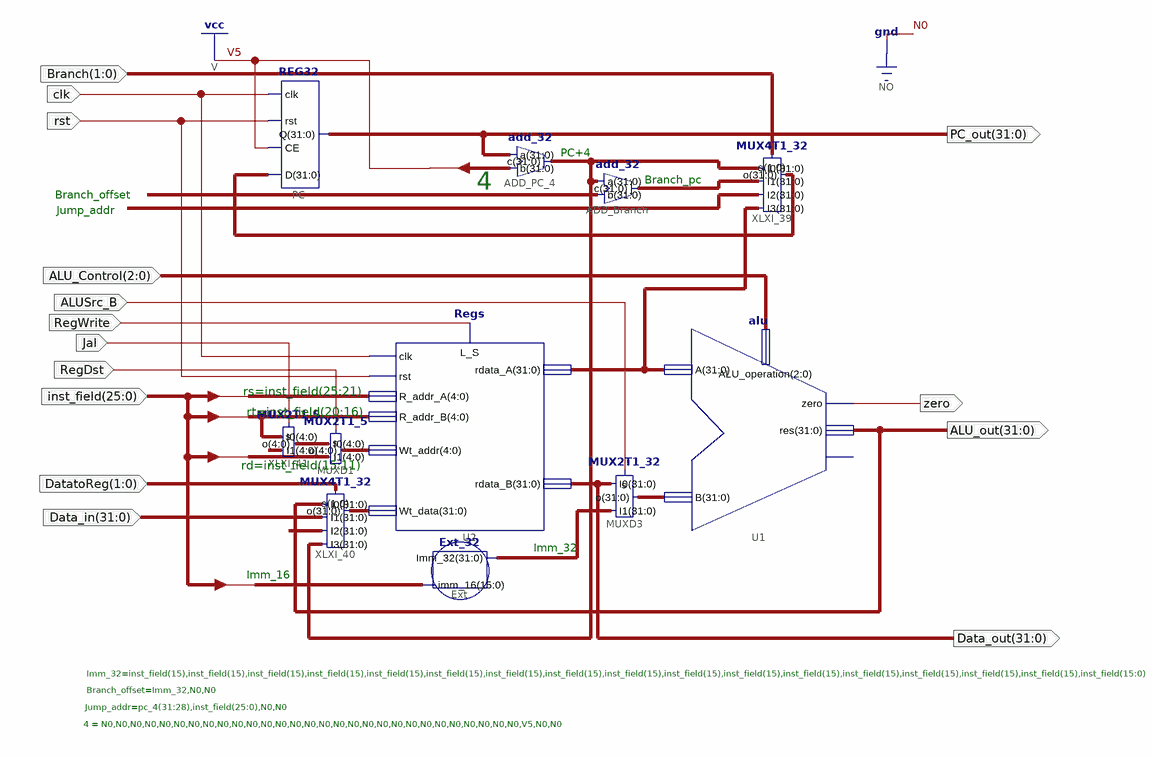
[diagram p0: schematic sheet 1]
// Xilinx ISE schematic Data_path.sch (kintex7) as structural Verilog: 11 symbols, 15 ports
module Data_path (
  input  RegDst,
  input  [31:0] Data_in,
  input  ALUSrc_B,
  input  RegWrite,
  input  [1:0] DatatoReg,
  input  clk,
  input  rst,
  input  [2:0] ALU_Control,
  input  [25:0] inst_field,
  input  [1:0] Branch,
  input  Jal,
  output [31:0] Data_out,
  output zero,
  output [31:0] PC_out,
  output [31:0] ALU_out
);

  wire [4:0] XLXN_59, XLXN_598;
  wire [15:0] inst;
  wire [31:0] branch_addr, Imm_32, pc_4, XLXN_414, XLXN_519, XLXN_531, XLXN_593;

  alu U1 (.zero(zero), .res(ALU_out), .A(XLXN_593), .B(XLXN_531), .ALU_operation(ALU_Control));  // open: overflow
  Regs U2 (
    .clk(clk), .L_S(RegWrite), .rdata_A(XLXN_593), .rst(rst), .Wt_data(XLXN_414), .rdata_B(Data_out),
    .R_addr_A(inst_field[25:21]), .R_addr_B(inst_field[20:16]), .Wt_addr(XLXN_59));
  add_32 ADD_Branch (.c(branch_addr), .a(pc_4), .b({Imm_32[29:0], 2'b00}));
  add_32 ADD_PC_4 (.c(pc_4), .a(PC_out), .b(32'b00000000000000000000000000000100));
  Ext_32 Ext (.imm_16(inst_field[15:0]), .Imm_32(Imm_32));
  REG32 PC (.D(XLXN_519), .CE(1'b1), .rst(rst), .clk(clk), .Q(PC_out));
  MUX2T1_32 MUXD3 (.s(ALUSrc_B), .I0(Data_out), .I1(Imm_32), .o(XLXN_531));
  MUX2T1_5 MUXD1 (.I1(inst_field[15:11]), .I0(XLXN_598), .o(XLXN_59), .s(RegDst));
  MUX4T1_32 XLXI_39 (
    .s(Branch), .I0(pc_4), .I1(branch_addr), .I2({pc_4[31:28], inst_field, 2'b00}), .I3(XLXN_593),
    .o(XLXN_519));
  MUX4T1_32 XLXI_40 (.s(DatatoReg), .I0(ALU_out), .I1(Data_in), .I2({inst, {16{1'b0}}}), .I3(pc_4), .o(XLXN_414));
  MUX2T1_5 XLXI_41 (.I1({5{1'b1}}), .I0(inst_field[20:16]), .o(XLXN_598), .s(Jal));

  // Notes on the sheet:
  //   PC+4
  //   Branch_pc
  //   4
  //   Branch_offset
  //   Jump_addr
  //   rs=inst_field(25:21)
  //   rt=inst_field(20:16)
  //   rd=inst_field(15:11)
  //   Imm_32
  //   Imm_16
  //   Imm_32=inst_field(15),inst_field(15),inst_field(15),inst_field(15),inst_field(15),inst_field(15),inst_field(15),inst_field(15),inst_field(15),inst_field(15),inst_field(15),inst_field(15),inst_field(15),inst_field(15),inst_field(15),inst_field(15),inst_field(15:0)
  //   Branch_offset=Imm_32,N0,N0
  //   Jump_addr=pc_4(31:28),inst_field(25:0),N0,N0
  //   4 = N0,N0,N0,N0,N0,N0,N0,N0,N0,N0,N0,N0,N0,N0,N0,N0,N0,N0,N0,N0,N0,N0,N0,N0,N0,N0,N0,N0,N0,V5,N0,N0
endmodule
